# EAGLE schematic DVI_Pmod (EAGLE 8.2.2)
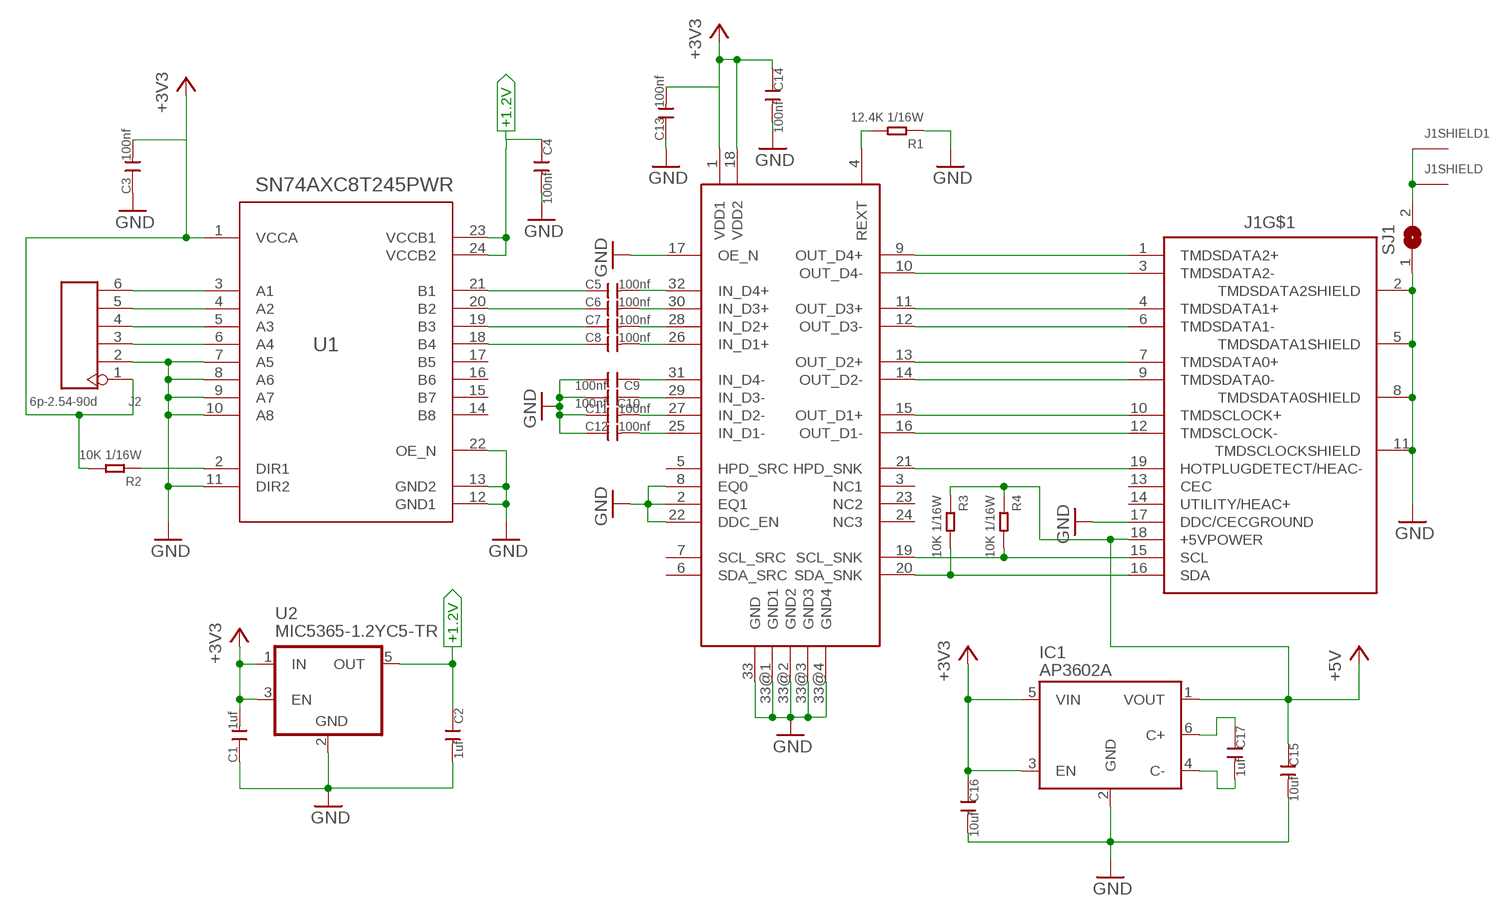
[diagram p0: schematic, sheet 1]

## Parts
C1  1uf  CERAMIC-1UF-10V-10%-X5R(0402)  [C0402]
C2  1uf  CERAMIC-1UF-10V-10%-X5R(0402)  [C0402]
C3  100nf  CERAMIC-100NF-25V-10%-X7R(0402)  [C0402]
C4  100nf  CERAMIC-100NF-25V-10%-X7R(0402)  [C0402]
C5  100nf  CERAMIC-100NF-25V-10%-X7R(0402)  [C0402]
C6  100nf  CERAMIC-100NF-25V-10%-X7R(0402)  [C0402]
C7  100nf  CERAMIC-100NF-25V-10%-X7R(0402)  [C0402]
C8  100nf  CERAMIC-100NF-25V-10%-X7R(0402)  [C0402]
C9  100nf  CERAMIC-100NF-25V-10%-X7R(0402)  [C0402]
C10  100nf  CERAMIC-100NF-25V-10%-X7R(0402)  [C0402]
C11  100nf  CERAMIC-100NF-25V-10%-X7R(0402)  [C0402]
C12  100nf  CERAMIC-100NF-25V-10%-X7R(0402)  [C0402]
C13  100nf  CERAMIC-100NF-25V-10%-X7R(0402)  [C0402]
C14  100nf  CERAMIC-100NF-25V-10%-X7R(0402)  [C0402]
C15  10uf  CERAMIC-10UF-25V-10%-X5R(0805)  [C0805]
C16  10uf  CERAMIC-10UF-10V-10%-X5R(0603)  [C0603]
C17  1uf  CERAMIC-1UF-25V-10%-X7R(0603)  [C0603]
IC1  AP3602A  REG710XX-5.0  [SOT23-6]
J1  685119134923  [685119134923]
J2  6p-2.54-90d  DIP-BLACK-SHORT-MALE-HEADER-R/A(6P-2.54-90D)  [H6-2.54-90D-MALE]
R1  12.4K 1/16W  SMD-RES-10K-1%-1/16W(0402)  [R0402]
R2  10K 1/16W  SMD-RES-10K-1%-1/16W(0402)  [R0402]
R3  10K 1/16W  SMD-RES-10K-1%-1/16W(0402)  [R0402]
R4  10K 1/16W  SMD-RES-10K-1%-1/16W(0402)  [R0402]
SJ1  SJ  [SJ]
U1  SN74AXC8T245PWR  [SOP65P640X120-24N]
U2  MIC5365-1.2YC5-TR  MIC5365/6C5  [SC70-5]
U$1  PTN3366  [SOT617-3]

## Nets
+1.2V [POWER]: C2.1 C4.1 U1.23(VCCB1) U1.24(VCCB2) U2.5(OUT)
+3V3 [POWER]: C1.2 C3.2 C13.2 C14.1 C16.1 IC1.3(EN) IC1.5(VIN) J2.1 R2.2 U1.1(VCCA) U2.1(IN) U2.3(EN) U$1.1(VDD1) U$1.18(VDD2)
+5V [POWER]: C15.1 IC1.1(VOUT) J1.18(+5VPOWER) R3.1 R4.1
GND [POWER]: C1.1 C2.2 C3.1 C4.2 C9.2 C10.2 C11.1 C12.1 C13.1 C14.2 C15.2 C16.2 IC1.2(GND) J1.2(TMDSDATA2SHIELD) J1.5(TMDSDATA1SHIELD) J1.8(TMDSDATA0SHIELD) J1.11(TMDSCLOCKSHIELD) J1.17(DDC/CECGROUND) J2.2 R1.1 SJ1.1 U1.7(A5) U1.8(A6) U1.9(A7) U1.10(A8) U1.11(DIR2) U1.12(GND1) U1.13(GND2) U1.22(OE_N) U2.2(GND) U$1.2(EQ1) U$1.8(EQ0) U$1.17(OE_N) U$1.22(DDC_EN) U$1.33(GND) U$1.33@1(GND1) U$1.33@2(GND2) U$1.33@3(GND3) U$1.33@4(GND4)
N$1: J1.1(TMDSDATA2+) U$1.9(OUT_D4+)
N$2: J1.3(TMDSDATA2-) U$1.10(OUT_D4-)
N$3: J1.4(TMDSDATA1+) U$1.11(OUT_D3+)
N$4: J1.6(TMDSDATA1-) U$1.12(OUT_D3-)
N$5: J1.7(TMDSDATA0+) U$1.13(OUT_D2+)
N$6: J1.9(TMDSDATA0-) U$1.14(OUT_D2-)
N$7: J1.10(TMDSCLOCK+) U$1.15(OUT_D1+)
N$8: J1.12(TMDSCLOCK-) U$1.16(OUT_D1-)
N$9: C5.2 U$1.32(IN_D4+)
N$10: C6.2 U$1.30(IN_D3+)
N$11: C7.2 U$1.28(IN_D2+)
N$12: C8.2 U$1.26(IN_D1+)
N$13: C9.1 U$1.31(IN_D4-)
N$14: C10.1 U$1.29(IN_D3-)
N$15: C11.2 U$1.27(IN_D2-)
N$16: C12.2 U$1.25(IN_D1-)
N$17: J2.6 U1.3(A1)
N$18: C5.1 U1.21(B1)
N$19: C6.1 U1.20(B2)
N$20: C7.1 U1.19(B3)
N$21: C8.1 U1.18(B4)
N$22: J2.5 U1.4(A2)
N$23: J2.4 U1.5(A3)
N$24: J2.3 U1.6(A4)
N$25: R2.1 U1.2(DIR1)
N$26: R1.2 U$1.4(REXT)
N$27 [POWER]: J1.SHELL1(SHIELD1:SHIELD) J1.SHELL(SHIELD:SHIELD) SJ1.2
N$29: J1.16(SDA) R3.2 U$1.20(SDA_SNK)
N$30: C17.1 IC1.6(C+)
N$31: J1.19(HOTPLUGDETECT/HEAC-) U$1.21(HPD_SNK)
N$32: C17.2 IC1.4(C-)
N$33: J1.15(SCL) R4.2 U$1.19(SCL_SNK)
Unconnected: J1.13(CEC) J1.14(UTILITY/HEAC+) J1.SHELL2(SHIELD2:SHIELD) J1.SHELL3(SHIELD3:SHIELD) U1.14(B8) U1.15(B7) U1.16(B6) U1.17(B5) U$1.3(NC1) U$1.5(HPD_SRC) U$1.6(SDA_SRC) U$1.7(SCL_SRC) U$1.23(NC2) U$1.24(NC3)

## Library data of the parts
C1 C2 = Seeed-Capacitor:CERAMIC-1UF-10V-10%-X5R(0402): 302010040; MPN: CC0402KRX5R6BB105
C3-C14 = Seeed-Capacitor:CERAMIC-100NF-25V-10%-X7R(0402): 302010024; MPN: CC0402KRX7R8BB104
C15 = Seeed-Capacitor:CERAMIC-10UF-25V-10%-X5R(0805): 302010178; MPN: CC0805KKX5R8BB106
C16 = Seeed-Capacitor:CERAMIC-10UF-10V-10%-X5R(0603): 302010103; MPN: CC0603KRX5R6BB106
C17 = Seeed-Capacitor:CERAMIC-1UF-25V-10%-X7R(0603): 302010139; MPN: CC0603KRX7R8BB105
IC1 = we-power:REG710XX: TI REG710xx Charge Pump with Regulated Output TI REG710xx (60mA) 5.5V - REG71055 5.0V - REG71050 3.3V - REG710NA-3.3 3.0V - REG710NA-3 2.7V - REG710NA-2.7 2.5V - REG710NA-2.5 Diodes AP3602 (100mA) 5.0V - AP3602A 4.5V - AP3602B OnSemi CAT3200 (100mA) 5.0V - CAT3200TDI
J1 = InputOutputIO (rev18a):685119134923: WR-COM SMT Horizontal HDMI, 19 pins=>Code : Con_I-O_COM_HDMI_685119134923 <http://katalog.we-online.de/media/images/eican/Con_I-O_COM_HDMI_685119134923_pf2.jpg> Details see: http://katalog.we-online.de/en/em/COM_SMT_HORIZONTAL/685119134923 Created 2014-07-09, Karrer Zheng 2014 (C) Würth Elektronik
J2 = Seeed-Connector:DIP-BLACK-SHORT-MALE-HEADER-R/A(6P-2.54-90D): 320020019
R1 = Seeed-Resistor:SMD-RES-10K-1%-1/16W(0402): 301010047; MPN: RC0402FR-0710KL; VALUE: 10K 1/16W
R2-R4 = Seeed-Resistor:SMD-RES-10K-1%-1/16W(0402): 301010047; MPN: RC0402FR-0710KL
SJ1 = jumper:SJ: SMD solder JUMPER
U1 = SN74AXC8T245PWR:SN74AXC8T245PWR: SN74AXC8T245 - 8-Bit Dual-Supply Bus Transceiver With Configurable Voltage Translation and Tri-State Outputs.
U2 = micrel:MIC5365/6: LDO VOLTAGE REGULATOR
U$1 = InputOutputIO (rev18a):PTN3366: PTN3366 - Low power HDMI/DVI level shifter with active DDC buffer, supporting 3Gbit/s operation.

## Net classes
1 POWER: width 0.203 mm